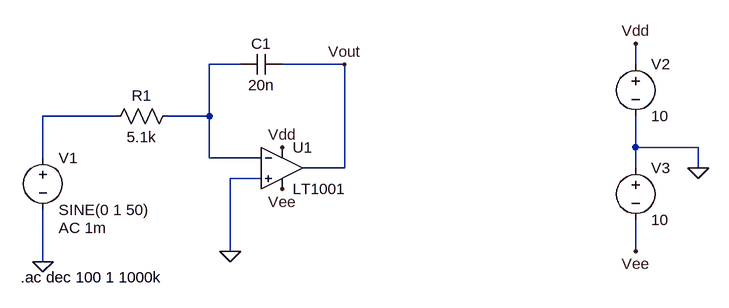
[diagram p0: schematic EJ3-b.asc]
EJ3-b.asc, the LTspice schematic file:
Version 4
SHEET 1 980 680
WIRE 224 96 176 96
WIRE 384 96 288 96
WIRE 832 96 832 64
WIRE 32 176 -80 176
WIRE 176 176 176 96
WIRE 176 176 112 176
WIRE 832 224 832 176
WIRE 928 224 832 224
WIRE -80 240 -80 176
WIRE 176 240 176 176
WIRE 256 240 176 240
WIRE 384 256 384 96
WIRE 384 256 320 256
WIRE 832 256 832 224
WIRE 928 256 928 224
WIRE 256 272 208 272
WIRE 208 384 208 272
WIRE 832 384 832 336
WIRE -80 400 -80 320
FLAG -80 400 0
FLAG 208 384 0
FLAG 384 96 Vout
FLAG 928 256 0
FLAG 832 384 Vee
FLAG 288 288 Vee
FLAG 832 64 Vdd
FLAG 288 224 Vdd
SYMBOL cap 288 80 R90
WINDOW 0 0 32 VBottom 2
WINDOW 3 32 32 VTop 2
SYMATTR InstName C1
SYMATTR Value 20n
SYMBOL res 128 160 R90
WINDOW 0 0 56 VBottom 2
WINDOW 3 32 56 VTop 2
SYMATTR InstName R1
SYMATTR Value 5.1k
SYMBOL voltage -80 224 R0
WINDOW 123 24 124 Left 2
WINDOW 39 0 0 Left 0
SYMATTR InstName V1
SYMATTR Value SINE(0 1 50)
SYMATTR Value2 AC 1m
SYMBOL OpAmps\\LT1001 288 192 R0
SYMATTR InstName U1
SYMBOL voltage 832 80 R0
WINDOW 123 0 0 Left 0
WINDOW 39 0 0 Left 0
SYMATTR InstName V2
SYMATTR Value 10
SYMBOL voltage 832 240 R0
WINDOW 123 0 0 Left 0
WINDOW 39 0 0 Left 0
SYMATTR InstName V3
SYMATTR Value 10
TEXT -114 424 Left 2 !.ac dec 100 1 1000k

The netlist it stands for:
* EJ3-b.asc
C1 Vout N001 20n
R1 N001 N002 5.1k
V1 N002 0 SINE(0 1 50) AC 1m
XU1 0 N001 Vdd Vee Vout LT1001  ; pins In+ In- V+ V- OUT
V2 Vdd 0 10
V3 0 Vee 10
.ac dec 100 1 1000k
.lib LTC.lib
.backanno
.end